# EAGLE schematic Lenovo_Scanner (EAGLE 8.2.2)
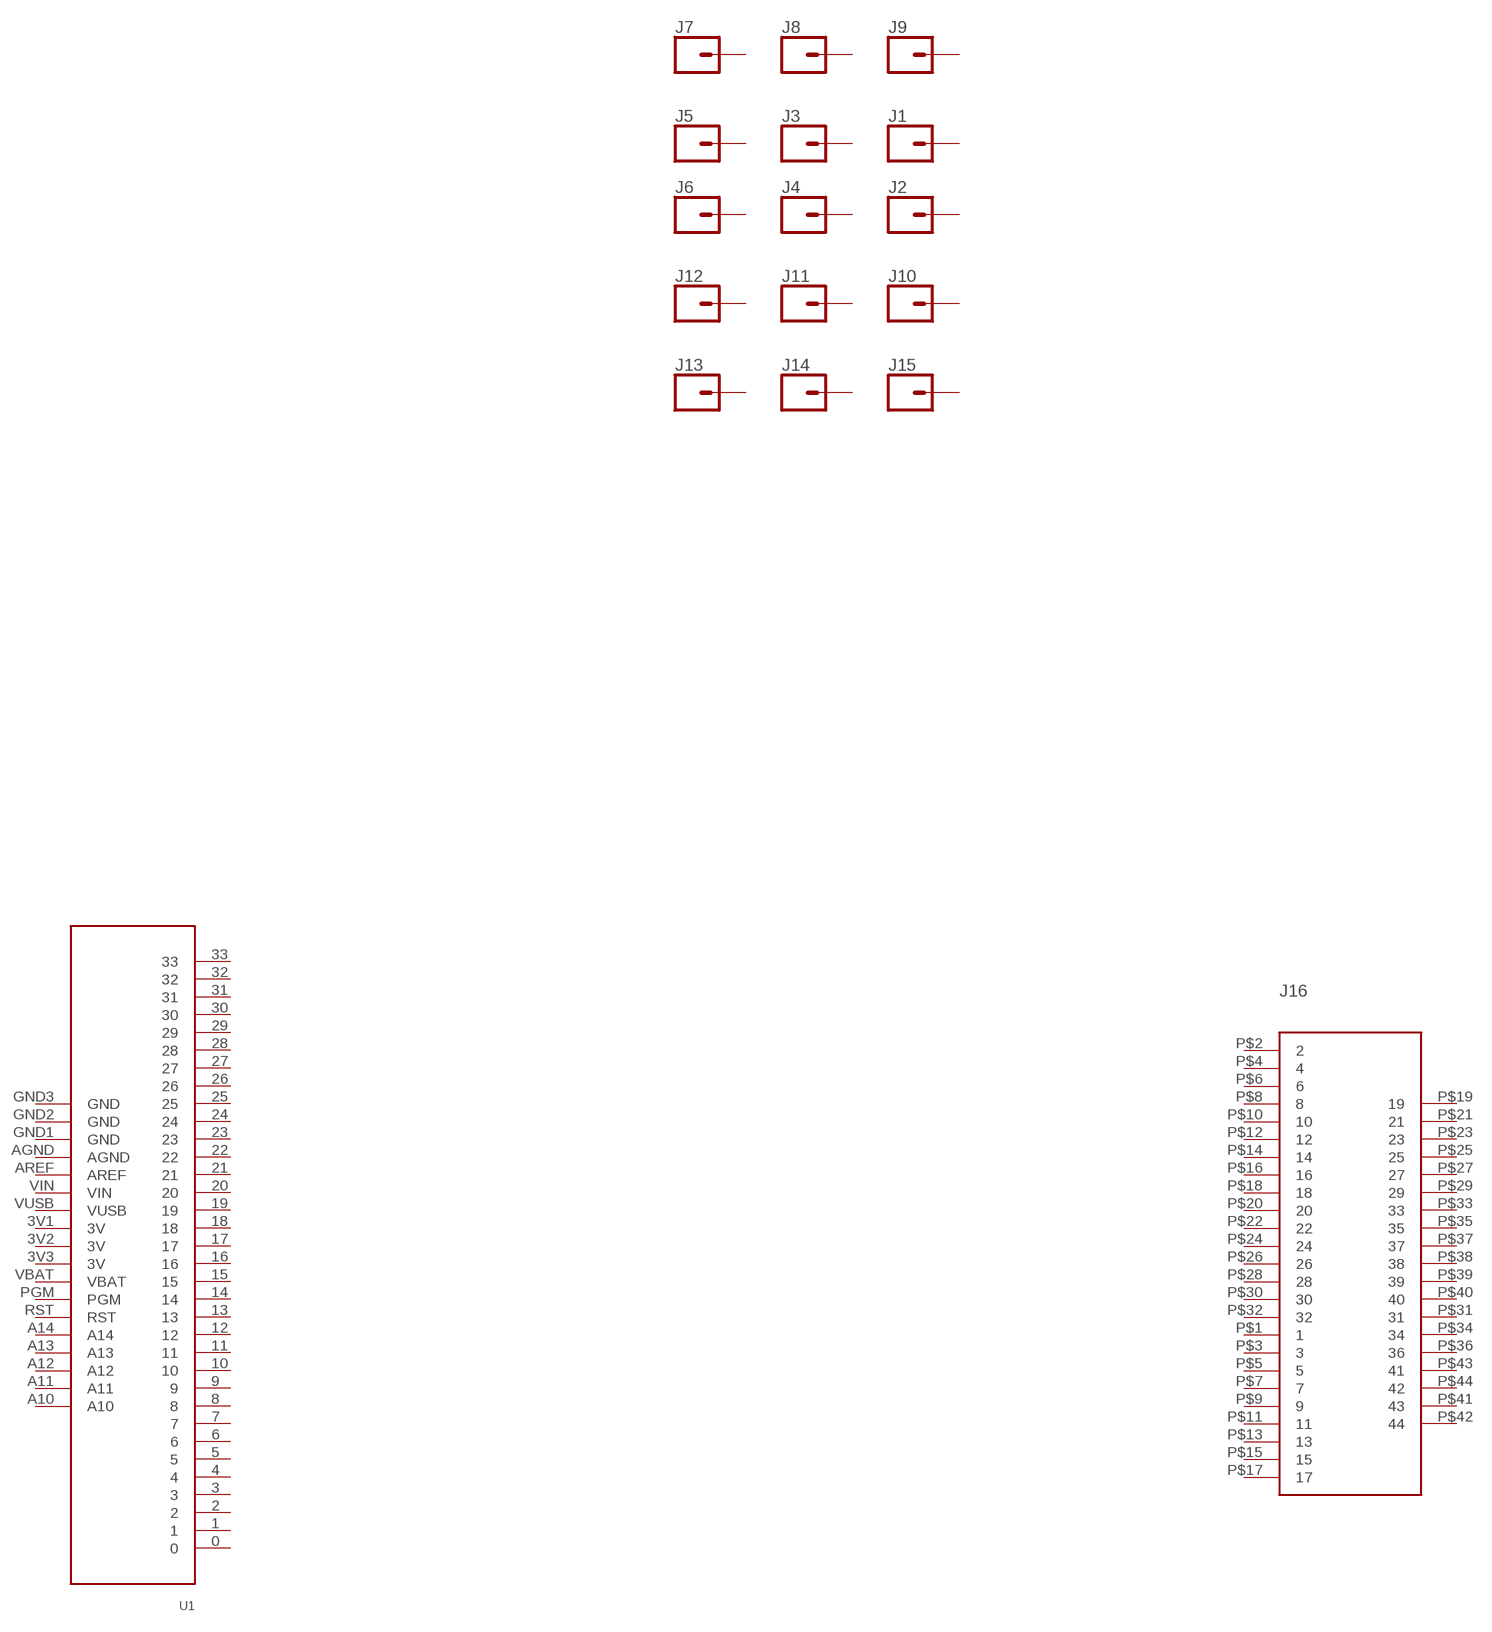
[diagram p0: schematic, sheet 1]

## Parts
J1  CONN_01  [1X01]
J2  CONN_01  [1X01]
J3  CONN_01  [1X01]
J4  CONN_01  [1X01]
J5  CONN_01  [1X01]
J6  CONN_01  [1X01]
J7  CONN_01  [1X01]
J8  CONN_01  [1X01]
J9  CONN_01  [1X01]
J10  CONN_01  [1X01]
J11  CONN_01  [1X01]
J12  CONN_01  [1X01]
J13  CONN_01  [1X01]
J14  CONN_01  [1X01]
J15  CONN_01  [1X01]
J16  WM6787CT-ND  [WM6787CT-ND]
U1  TEENSY_3P2  [TEENSY_3P2]
Unconnected: J1.1 J2.1 J3.1 J4.1 J5.1 J6.1 J7.1 J8.1 J9.1 J10.1 J11.1 J12.1 J13.1 J14.1 J15.1 J16.P$1 J16.P$2 J16.P$3 J16.P$4 J16.P$5 J16.P$6 J16.P$7 J16.P$8 J16.P$9 J16.P$10 J16.P$11 J16.P$12 J16.P$13 J16.P$14 J16.P$15 J16.P$16 J16.P$17 J16.P$18 J16.P$19 J16.P$20 J16.P$21 J16.P$22 J16.P$23 J16.P$24 J16.P$25 J16.P$26 J16.P$27 J16.P$28 J16.P$29 J16.P$30 J16.P$31 J16.P$32 J16.P$33 J16.P$34 J16.P$35 J16.P$36 J16.P$37 J16.P$38 J16.P$39 J16.P$40 J16.P$41 J16.P$42 J16.P$43 J16.P$44 U1.0 U1.1 U1.2 U1.3 U1.4 U1.5 U1.6 U1.7 U1.8 U1.9 U1.10 U1.11 U1.12 U1.13 U1.14 U1.15 U1.16 U1.17 U1.18 U1.19 U1.20 U1.21 U1.22 U1.23 U1.24 U1.25 U1.26 U1.27 U1.28 U1.29 U1.30 U1.31 U1.32 U1.33 U1.A10 U1.A11 U1.A12 U1.A13 U1.A14 U1.PGM U1.RST

## Power pins joined to a net without a drawn wire
3V: U1.3V1(3V) U1.3V2(3V) U1.3V3(3V)
AGND: U1.AGND
AREF: U1.AREF
GND: U1.GND1(GND) U1.GND2(GND) U1.GND3(GND)
VBAT: U1.VBAT
VIN: U1.VIN
VUSB: U1.VUSB

## Library data of the parts
J1-J15 = SparkFun-Connectors:CONN_01: Single connection point. Often used as Generic Header-pin footprint for 0.1 inch spaced/style header connections On any of the 0.1 inch spaced packages, you can populate with these: Break Away Headers - Straight <https://www.sparkfun.com/products/116> (PRT-00116) Break Away Male Headers - Right Angle <https://www.sparkfun.com/products/553> (PRT-00553) Female Headers <https://www.sparkfun.com/products/115> (PRT-00115) Break Away Headers - Machine Pin <https://www.sparkfun.com/products/117> (PRT-00117) Break Away Female Headers - Swiss Machine Pin <https://www.sparkfun.com/products/743> (PRT-00743) This device is also useful as a general connection point to wire up your design to another part of your project. Our various solder wires solder well into these plated through hole pads. Hook-Up Wire - Assortment (Stranded, 22 AWG) <https://www.sparkfun.com/products/11375> (PRT-11375) Hook-Up Wire - Assortment (Solid Core, 22 AWG) <https://www.sparkfun.com/products/11367> (PRT-11367) View the entire wire category on our website here <https://www.sparkfun.com/categories/141> Special notes: SMTSO-256-ET is a "flush mount" nut for a 4-40 screw. We mostly use this on specialty testbeds; it is a nice way to connect hardware to your PCB at an adjustable hieght. Also note, the SNAP packages are for using a snappable style connector. We sell a baggie of snaps and they are also used on two LilyPad designs: Snap Assortment - 30 pack (male and female) <https://www.sparkfun.com/products/11347> (DEV-11347) LilyPad Arduino SimpleSnap <https://www.sparkfun.com/products/10941> (DEV-10941) LilyPad SimpleSnap Protoboard <https://www.sparkfun.com/products/10940> (DEV-10940)
J16 = WM6787CT-ND:WM6787CT-ND: WM6787CT-ND - Motherboard keyboard connector Digikey part number WM6787CT-ND Molex part number 0543630489 Technical Specifications: 40 signal pins, odds on top, evens on bottom Pin Pitch is 0.5mm 4 additional ground pins on the corners
U1 = Teensy_3p2:TEENSY_3P2: Teensy 3.2 - Microcontroller Technical Specifications: VCC: 3.3V signals, 5V tolerant 72 MHz Cortex-M4 32 bit ARM Processor 100% Compatible with Teensy 3.1 pjrc.com/store/teensy32.html